# Altium schematic sheet [04] - Conectors.SchDoc
size A4
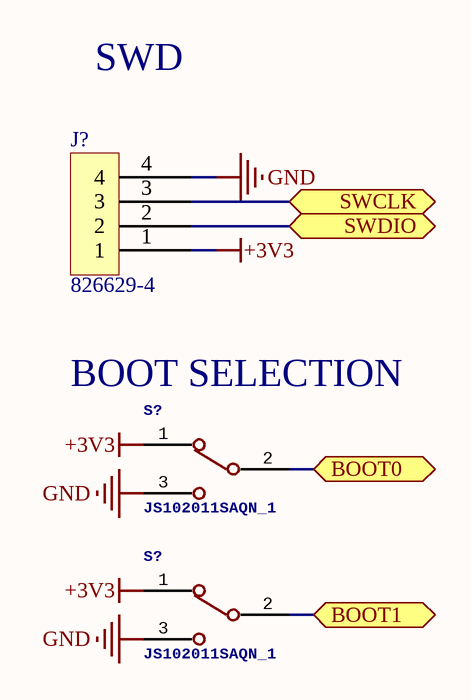
[diagram p0: [04] - Conectors.SchDoc]

## Parts
(Parts that share a designator on the sheet are numbered #1, #2 ... from top to bottom, then left to right.)
J?  826629-4  [826629-4]
S?#1  JS102011SAQN_1  [SW_JS102011SAQN]
S?#2  JS102011SAQN_1  [SW_JS102011SAQN]

## Ports
BOOT0, BOOT1, SWCLK, SWDIO

## Nets
+3V3: J?.1 S?#1.1 S?#2.1
GND: J?.4 S?#1.3 S?#2.3
BOOT0: S?#1.2 ; port BOOT0
BOOT1: S?#2.2 ; port BOOT1
SWCLK: J?.3 ; port SWCLK
SWDIO: J?.2 ; port SWDIO

## Notes on the sheet
- SWD
- (near S?#1) BOOT SELECTION

## Library data of the parts
J? = 826629-4: CONN HEADER VERT 4POS 2.54MM; Manufacturer: TE Connectivity AMP Connectors; Connector Type: Header, Breakaway; Pitch - Mating: 0.100" (2.54mm); Number of Positions: 4; Number of Positions Loaded: All; Style: Board to Board or Cable; Shrouding: Unshrouded; Contact Length - Mating: 0.264" (6.70mm); Contact Length - Post: 0.126" (3.20mm); Overall Contact Length: 0.500" (12.70mm); Material Flammability Rating: UL94 V-0; Current Rating: 5A; Supplier 1: Digi-Key; Manufacturer Part Number: 826629-4; RoHS: RoHS Compliant; Category: Connectors, Interconnects; Stock 1: 8170; Pricing 1: 1=0.46, 10=0.423, 100=0.3248, 500=0.28244, 1000=0.23301, 5000=0.20477, 10000=0.19065 (EUR); Packaging: Bulk; Part Status: Active; Contact Type: Male Pin; Number of Rows: 1; Row Spacing - Mating: -; Mounting Type: Through Hole; Termination: Solder; Fastening Type: Push-Pull; Insulation Height: 0.110" (2.79mm); Contact Shape: Square; Contact Finish - Mating: Gold; Contact Finish Thickness - Mating: 3.90µin (0.099µm); Contact Finish - Post: Tin; Contact Material: Brass; Insulation Material: Polybutylene Terephthalate (PBT); Features: -; Operating Temperature: -65°C ~ 105°C; Ingress Protection: -; Insulation Color: Green; Voltage Rating: -; Mated Stacking Heights: -; Contact Finish Thickness - Post: 118.1µin (3.00µm); Applications: -; ComponentLink1URL: https://www.te.com/commerce/DocumentDelivery/DDEController?Action=srchrtrv&DocNm=826629&DocType=Customer+Drawing&DocLang=English; ComponentLink1Description: https://www.te.com/commerce/DocumentDelivery/DDEController?Action=srchrtrv&DocNm=826629&DocType=Customer+Drawing&DocLang=English; Supplier Part Number 1: A106750-ND
S?#1 S?#2 = JS102011SAQN_1: JS10 Series SPDT On-On 6 V 0.3 A Gull Wing SMT Slide Switch; MF: C&K; Actuator: Standard; Voltage Rating DC: 6 VDC; Contact Current Rating: 0.3 A; Illuminated: Non-Illuminated; Travel: 2 mm; CNHTS: 8536500000; MXHTS: 85365099; TARIC: 8536501199; Package: None; Price: None; MP: JS102011SAQN; Availability: Unavailable; Supplier 1: Mouser; Manufacturer: C&K; Manufacturer Part Number: JS102011SAQN; RoHS: RoHS Compliant; Category: Slide Switches; Stock 1: 15689; Pricing 1: 1=0.445, 25=0.395, 50=0.369, 100=0.351, 250=0.299, 500=0.290, 1000=0.273, 2000=0.270 (EUR); Contact Form: SPDT; Illumination Colour: -; Packaging: Cut Tape; Series: JS; Switch Function: ON - ON; Termination Style: SMD/SMT; Brand: C&K; Lamp Type: -; Mounting Style: PCB Mount; HTS Code: 8536509050; Product Type: Slide Switches; Standard Pack Qty: 1000; Subcategory: Switches; RoHS - Mouser: Y; Minimum Order Quantity: 1; Reeling: True; ComponentLink1URL: http://www.mouser.com/datasheet/2/60/js-1382693.pdf; ComponentLink1Description: http://www.mouser.com/datasheet/2/60/js-1382693.pdf; Supplier Part Number 1: 611-JS102011SAQN